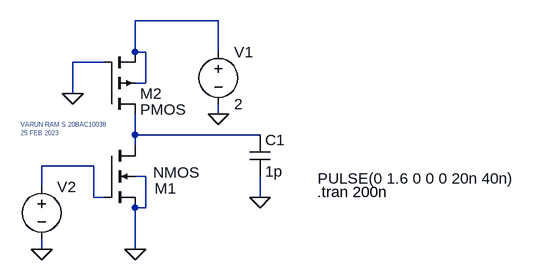
[diagram p0: schematic EXP5.asc]
EXP5.asc, the LTspice schematic file:
Version 4
SHEET 1 880 680
WIRE 368 -16 240 -16
WIRE 240 32 240 -16
WIRE 256 32 240 32
WIRE 368 32 368 -16
WIRE 192 48 144 48
WIRE 256 80 256 32
WIRE 256 80 240 80
WIRE 144 96 144 48
WIRE 368 128 368 112
WIRE 240 160 240 128
WIRE 432 160 240 160
WIRE 240 176 240 160
WIRE 176 208 96 208
WIRE 256 224 240 224
WIRE 96 240 96 208
WIRE 176 256 176 208
WIRE 192 256 176 256
WIRE 432 256 432 224
WIRE 256 272 256 224
WIRE 256 272 240 272
WIRE 96 336 96 320
WIRE 240 336 240 272
FLAG 144 96 0
FLAG 368 128 0
FLAG 432 256 0
FLAG 240 336 0
FLAG 96 336 0
SYMBOL nmos4 192 176 R0
WINDOW 0 78 66 Left 2
WINDOW 3 76 42 Left 2
SYMATTR InstName M1
SYMATTR Value2 l=180n w=4u
SYMBOL voltage 368 16 R0
WINDOW 123 0 0 Left 0
WINDOW 39 0 0 Left 0
SYMATTR InstName V1
SYMATTR Value 2
SYMBOL voltage 96 224 R0
WINDOW 3 425 3 Left 2
WINDOW 123 0 0 Left 0
WINDOW 39 0 0 Left 0
SYMATTR Value PULSE(0 1.6 0 0 0 20n 40n)
SYMATTR InstName V2
SYMBOL cap 416 160 R0
SYMATTR InstName C1
SYMATTR Value 1p
SYMBOL pmos4 192 128 M180
WINDOW 3 56 7 Left 2
SYMATTR InstName M2
SYMATTR Value2 l=180n w=4u
TEXT 520 248 Left 2 !.tran 200n
TEXT 64 144 Left 0 ;VARUN RAM S 20BAC10038\n25 FEB 2023

The netlist it stands for:
* EXP5.asc
M1 N002 N003 0 0 NMOS l=180n w=4u
V1 N001 0 2
V2 N003 0 PULSE(0 1.6 0 0 0 20n 40n)
C1 N002 0 1p
M2 N002 0 N001 N001 PMOS l=180n w=4u
.model NMOS NMOS
.model PMOS PMOS
.lib standard.mos
.tran 200n
* VARUN RAM S 20BAC10038
* 25 FEB 2023
.backanno
.end